# Altium project PCB_Project.PrjPcb
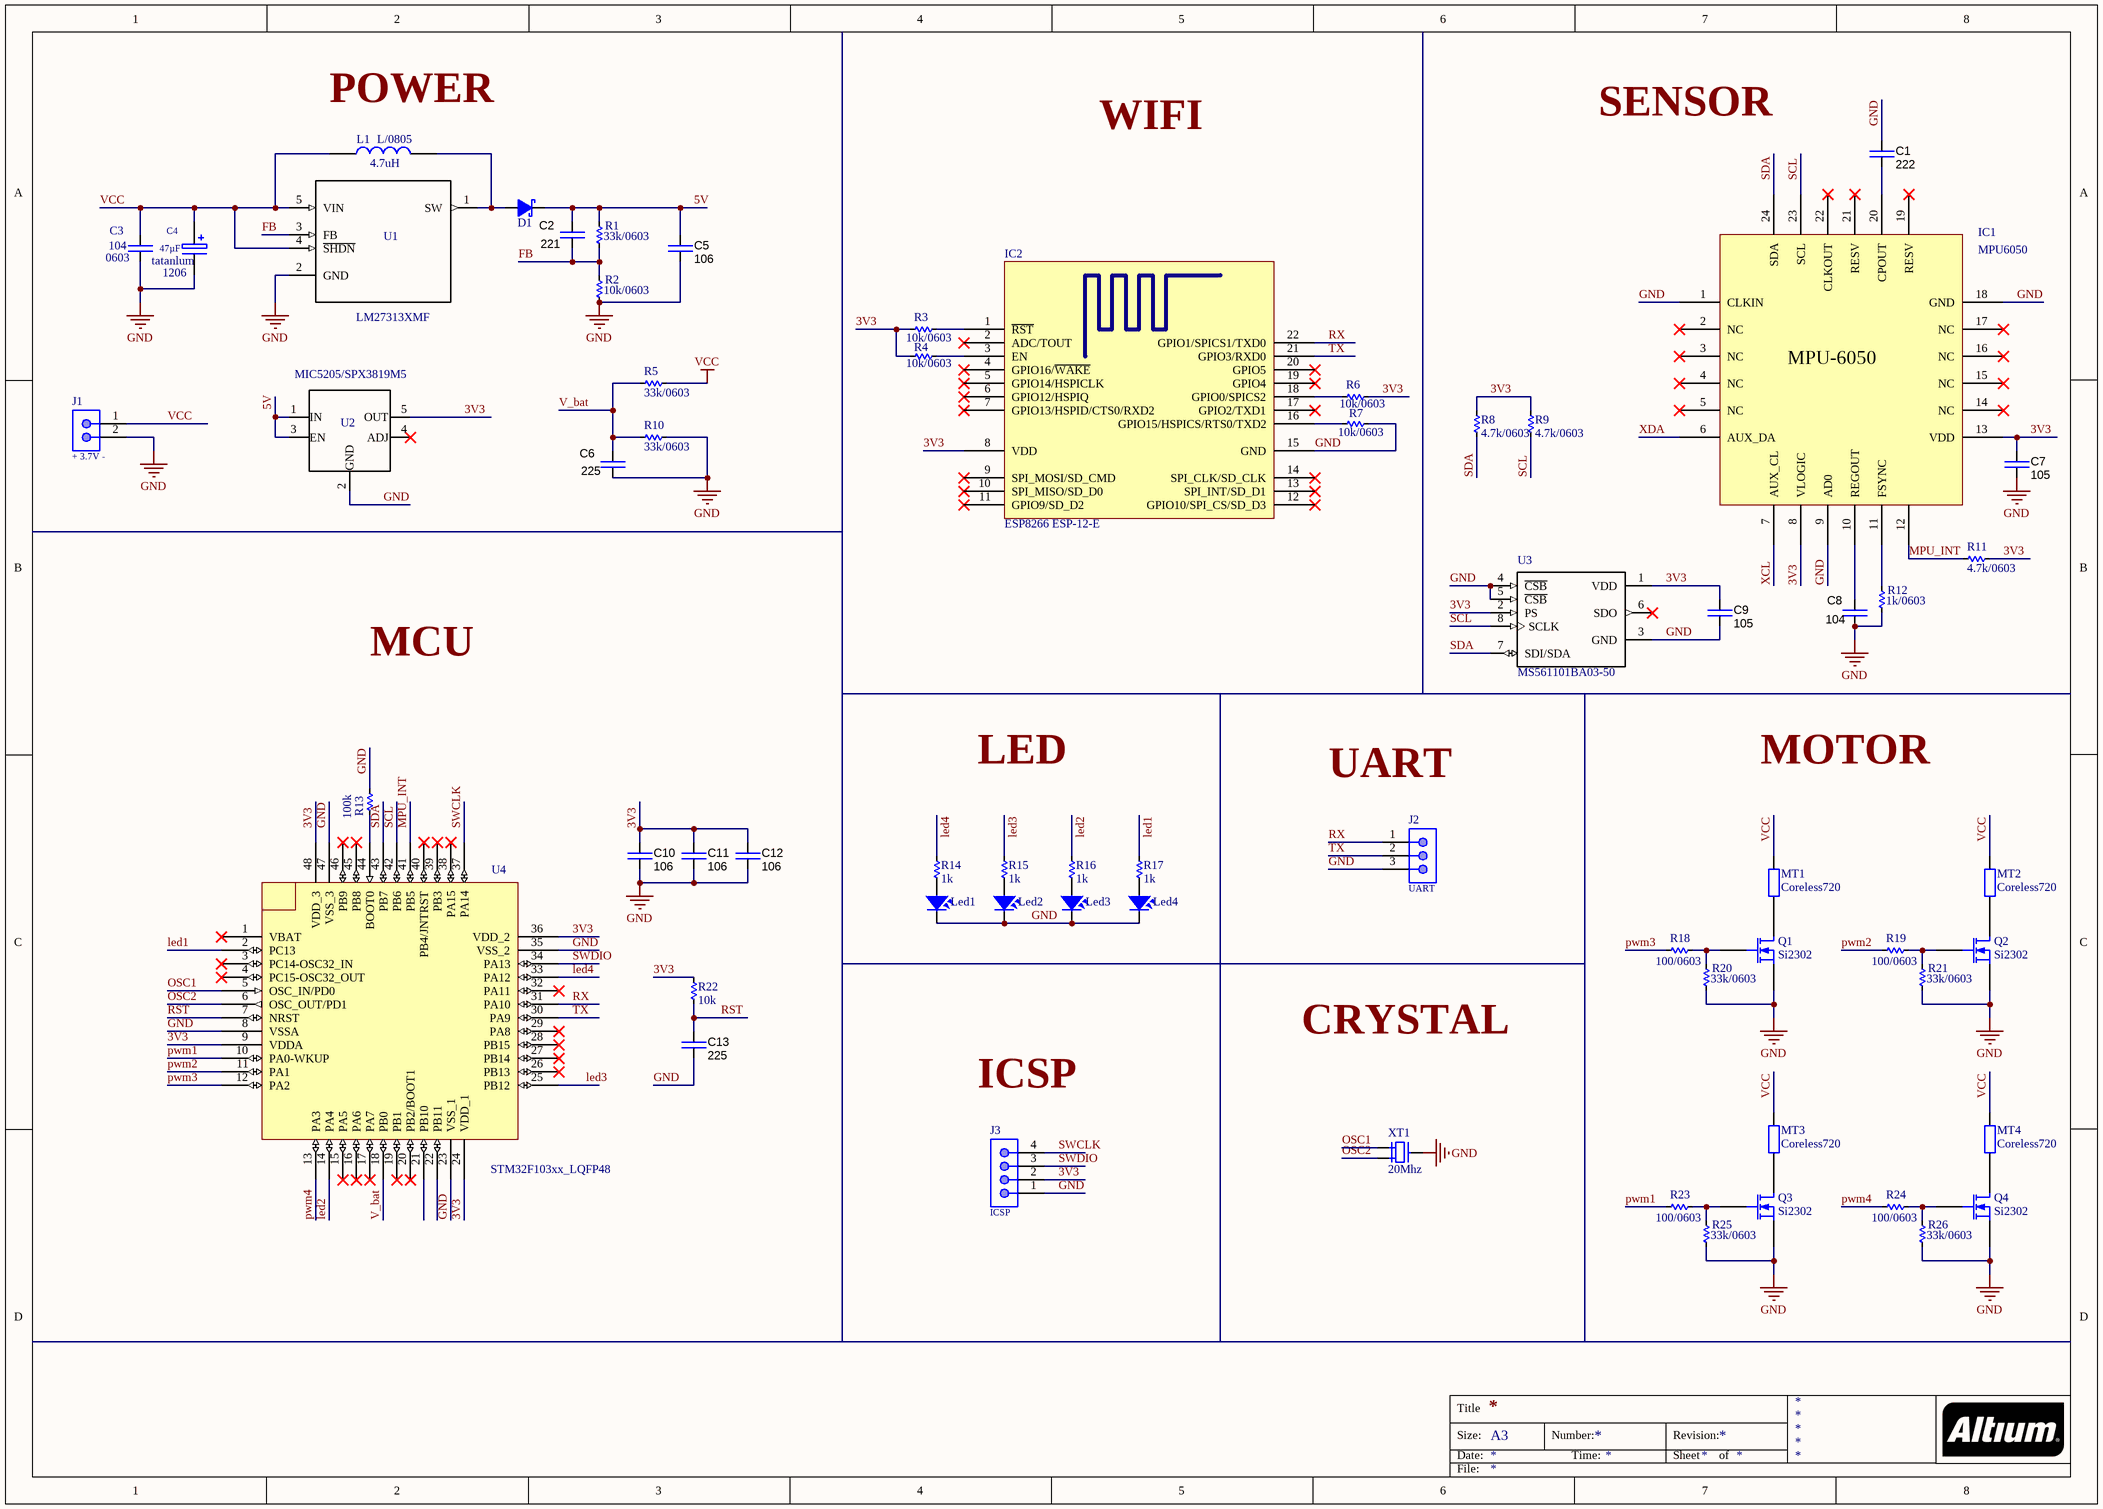
[diagram p0: Sheet1.SchDoc]
1 sheet, 63 parts. Net scope: global (net labels, ports and power ports of the same name join across sheets).
Board file: PCB1.PcbDoc

## Sheet Sheet1.SchDoc
size A3

### Parts
C1  222  [CAPC1608X90N]
C2  221  [CAPC1608X90N]
C3  104  Package / Case: 0603  [CAPC1608X90N]
C4  tatanlum  size: 1206  [CM_S_1206]
C5  106  [CAPC1608X90N]
C6  225  [CAPC1608X90N]
C7  105  [CAPC1608X90N]
C8  104  [CAPC1608X90N]
C9  105  [CAPC1608X90N]
C10  106  [CAPC1608X90N]
C11  106  [CAPC1608X90N]
C12  106  [CAPC1608X90N]
C13  225  [CAPC1608X90N]
D1  Diode  Schottky 1N5819  [DO-214AC]  (value not drawn)
IC1  MPU6050  [MPU6050]
IC2  ESP8266 ESP-12-E  [ESP8266 ESP-12-E]
J1  + 3.7V -  [62000211121]
J2  UART  [62000311121]
J3  ICSP  [62000411121]
L1  L/0805  value 4.7uH  [SM-IND-0805]
Led1  LED  [LED-0805-Red]  (value not drawn)
Led2  LED  [LED-0805-Red]  (value not drawn)
Led3  LED  [LED-0805-Red]  (value not drawn)
Led4  LED  [LED-0805-Red]  (value not drawn)
MT1  Coreless720  [SM-0805]
MT2  Coreless720  [SM-0805]
MT3  Coreless720  [SM-0805]
MT4  Coreless720  [SM-0805]
Q1  Si2302  [SOT23]
Q2  Si2302  [SOT23]
Q3  Si2302  [SOT23]
Q4  Si2302  [SOT23]
R1  33k/0603  [RES-SMD-0603]
R2  10k/0603  [RES-SMD-0603]
R3  10k/0603  [RES-SMD-0603]
R4  10k/0603  [RES-SMD-0603]
R5  33k/0603  [RES-SMD-0603]
R6  10k/0603  [RES-SMD-0603]
R7  10k/0603  [RES-SMD-0603]
R8  4.7k/0603  [RES-SMD-0603]
R9  4.7k/0603  [RES-SMD-0603]
R10  33k/0603  [RES-SMD-0603]
R11  4.7k/0603  [RES-SMD-0603]
R12  1k/0603  [RES-SMD-0603]
R13  100k  [RES-SMD-0603]
R14  1k  [RES-SMD-0603]
R15  1k  [RES-SMD-0603]
R16  1k  [RES-SMD-0603]
R17  1k  [RES-SMD-0603]
R18  100/0603  [RES-SMD-0603]
R19  100/0603  [RES-SMD-0603]
R20  33k/0603  [RES-SMD-0603]
R21  33k/0603  [RES-SMD-0603]
R22  10k  [RES-SMD-0603]
R23  100/0603  [RES-SMD-0603]
R24  100/0603  [RES-SMD-0603]
R25  33k/0603  [RES-SMD-0603]
R26  33k/0603  [RES-SMD-0603]
U1  LM27313XMF  [SOT95P285X120-5N]
U2  MIC5205/SPX3819M5  [SOT-23-5]
U3  MS561101BA03-50  [SON125P500X300X100-8N]
U4  STM32F103xx_LQFP48  [STM32_LQPF48]
XT1  20Mhz  [CRYSTAL CSTCE20M0V53-R0]

### Nets
GND: C1.2 C3.1 C4.2 C5.1 C6.1 C7.1 C8.1 C9.1 C10.1 C11.1 C12.1 C13.1 IC1.1(CLKIN) IC1.9(AD0) IC1.18(GND) IC2.15(GND) J1.2 J2.3 J3.1 Led1.2 Led2.2 Led3.2 Led4.2 Q1.2(S) Q2.2(S) Q3.2(S) Q4.2(S) R2.2 R7.1 R10.2 R12.2 R13.2 R20.2 R21.2 R25.2 R26.2 U1.2(GND) U2.2(GND) U3.3(GND) U3.4(~{CSB}) U3.5(~{CSB}) U4.8(VSSA) U4.23(VSS_1) U4.35(VSS_2) U4.47(VSS_3) XT1.2
VCC: C3.2 C4.1 J1.1 L1.1 MT1.2 MT2.2 MT3.2 MT4.2 R5.2 U1.4(~{SHDN}) U1.5(VIN)
3V3: C7.2 C9.2 C10.2 C11.2 C12.2 IC1.8(VLOGIC) IC1.13(VDD) IC2.8(VDD) J3.2 R3.2 R4.2 R6.1 R8.2 R9.2 R11.2 R22.2 U2.5(OUT) U3.1(VDD) U3.2(PS) U4.9(VDDA) U4.24(VDD_1) U4.36(VDD_2) U4.48(VDD_3)
5V: C2.2 C5.2 D1.K R1.1 U2.1(IN) U2.3(EN)
FB: C2.1 R1.2 R2.1 U1.3(FB)
led1: R17.2 U4.2(PC13)
led2: R16.2 U4.14(PA4)
led3: R15.2 U4.25(PB12)
led4: R14.2 U4.33(PA12)
MPU_INT: IC1.12 R11.1 U4.41(PB5)
OSC1: U4.5(OSC_IN/PD0) XT1.1
OSC2: U4.6(OSC_OUT/PD1) XT1.3
pwm1: R23.1 U4.10(PA0-WKUP)
pwm2: R19.1 U4.11(PA1)
pwm3: R18.1 U4.12(PA2)
pwm4: R24.1 U4.13(PA3)
RST: C13.2 R22.1 U4.7(NRST)
RX: IC2.22(GPIO1/SPICS1/TXD0) J2.1 U4.31(PA10)
SCL: IC1.23(SCL) R9.1 U3.8(SCLK) U4.42(PB6)
SDA: IC1.24(SDA) R8.1 U3.7(SDI/SDA) U4.43(PB7)
SWCLK: J3.4 U4.37(PA14)
SWDIO: J3.3 U4.34(PA13)
TX: IC2.21(GPIO3/RXD0) J2.2 U4.30(PA9)
V_bat: C6.2 R5.1 R10.1 U4.18(PB0)
XCL: IC1.7(AUX_CL)
XDA: IC1.6(AUX_DA)
NetC1_1: C1.1 IC1.20(CPOUT)
NetC8_2: C8.2 IC1.10(REGOUT)
NetD1_A: D1.A L1.2 U1.1(SW)
NetIC1_11: IC1.11(FSYNC) R12.1
NetIC2_1: IC2.1(~{RST}) R3.1
NetIC2_3: IC2.3(EN) R4.1
NetIC2_16: IC2.16(GPIO15/HSPICS/RTS0/TXD2) R7.2
NetIC2_18: IC2.18(GPIO0/SPICS2) R6.2
NetLed1_1: Led1.1 R14.1
NetLed2_1: Led2.1 R15.1
NetLed3_1: Led3.1 R16.1
NetLed4_1: Led4.1 R17.1
NetMT1_1: MT1.1 Q1.3(D)
NetMT2_1: MT2.1 Q2.3(D)
NetMT3_1: MT3.1 Q3.3(D)
NetMT4_1: MT4.1 Q4.3(D)
NetQ1_1: Q1.1(G) R18.2 R20.1
NetQ2_1: Q2.1(G) R19.2 R21.1
NetQ3_1: Q3.1(G) R23.2 R25.1
NetQ4_1: Q4.1(G) R24.2 R26.1
NetR13_1: R13.1 U4.44(BOOT0)

Not connected (* = marked no-connect by the designer): IC1 2(NC)* 3(NC)* 4(NC)* 5(NC)* 14(NC)* 15(NC)* 16(NC)* 17(NC)* 19(RESV)* 21(RESV)* 22(CLKOUT)*; IC2 2(ADC/TOUT)* 4(GPIO16/~{WAKE})* 5(GPIO14/HSPICLK)* 6(GPIO12/HSPIQ)* 7(GPIO13/HSPID/CTS0/RXD2)* 9(SPI_MOSI/SD_CMD)* 10(SPI_MISO/SD_D0)* 11(GPIO9/SD_D2)* 12(GPIO10/SPI_CS/SD_D3)* 13(SPI_INT/SD_D1)* 14(SPI_CLK/SD_CLK)* 17(GPIO2/TXD1)* 19(GPIO4)* 20(GPIO5)*; U2 4(ADJ)*; U3 6(SDO)*; U4 1(VBAT)* 3(PC14-OSC32_IN)* 4(PC15-OSC32_OUT)* 15(PA5)* 16(PA6)* 17(PA7)* 19(PB1)* 20(PB2/BOOT1)* 21(PB10) 22(PB11) 26(PB13)* 27(PB14)* 28(PB15)* 29(PA8)* 32(PA11)* 38(PA15)* 39(PB3)* 40(PB4/JNTRST)* 45(PB8)* 46(PB9)*

### Notes on the sheet
- (near L1) POWER
- WIFI
- SENSOR
- MCU
- LED
- UART
- MOTOR
- CRYSTAL
- ICSP
- Title
- Size:
- Date:
- A3
- Number:
- Time:
- Revision:
- Sheet
- of
- File:
- (in symbol CAP Tatalium) 47µF
- (in symbol MPU6050) MPU-6050

### Library data of the parts
C1 C2 C5-C13 = CAP C_0603: Capacitor SMD Cer 470nF 10% 16V X7R 0603; Manufacturer 1: Murata Electronics North America; Manufacturer Part Number 1: GRM188R71C474KA88D; Ratings: 16V; X7R; Material: ceramic; SCDType: spec; Package / Case: 0603 (1608 metric); Tolerance: ±10%; Manufacturer 2: TDK Corporation; Manufacturer Part Number 2: C1608X7R1C474K; Supplier 1: Digi-Key; Supplier Part Number 1: 490-3295-2-ND; Supplier 2: Digi-Key; Supplier Part Number 2: 445-5192-2-ND; Supplier 3: Digi-Key; Supplier Part Number 3: 587-1250-2-ND; Manufacturer 3: Taiyo Yuden; Manufacturer Part Number 3: EMK107B7474KA-T; Manufacturer 4: Samsung; Manufacturer Part Number 4: CL10B474KONE; ComponentLink1URL: http://psearch.murata.com/capacitor/product/GRM188R71C474KA88#.pdf; ComponentLink1Description: http://psearch.murata.com/capacitor/product/GRM188R71C474KA88#.pdf; ComponentLink2URL: http://product.tdk.com/capacitor/mlcc/en/documents/mlcc_commercial_general_en.pdf; ComponentLink2Description: http://product.tdk.com/capacitor/mlcc/en/documents/mlcc_commercial_general_en.pdf; ComponentLink3URL: http://www.yuden.co.jp/or/product/category/capacitor/EMK107B7474KA-T.pdf; ComponentLink3Description: http://www.yuden.co.jp/or/product/category/capacitor/EMK107B7474KA-T.pdf
  C1: Value: 222
  C2: Value: 221
  C5 C10-C12: Value: 106
  C6 C13: Value: 225
  C7 C9: Value: 105
  C8: Value: 104
C3 = CAP C_0603: Capacitor SMD 224/0603, Addr:Linhkien69.vn; Manufacturer 1: Murata Electronics North America; Manufacturer Part Number 1: GRM188R71C474KA88D; Tolerance: ±10%; Ratings: 16V; X7R; Material: ceramic; SCDType: spec; Value: 470n; Manufacturer 2: TDK Corporation; Manufacturer Part Number 2: C1608X7R1C474K; Supplier 1: Digi-Key; Supplier Part Number 1: 490-3295-2-ND; Supplier 2: Digi-Key; Supplier Part Number 2: 445-5192-2-ND; Supplier 3: Digi-Key; Supplier Part Number 3: 587-1250-2-ND; Manufacturer 3: Taiyo Yuden; Manufacturer Part Number 3: EMK107B7474KA-T; Manufacturer 4: Samsung; Manufacturer Part Number 4: CL10B474KONE; ComponentLink1URL: http://psearch.murata.com/capacitor/product/GRM188R71C474KA88#.pdf; ComponentLink1Description: http://psearch.murata.com/capacitor/product/GRM188R71C474KA88#.pdf; ComponentLink2URL: http://product.tdk.com/capacitor/mlcc/en/documents/mlcc_commercial_general_en.pdf; ComponentLink2Description: http://product.tdk.com/capacitor/mlcc/en/documents/mlcc_commercial_general_en.pdf; ComponentLink3URL: http://www.yuden.co.jp/or/product/category/capacitor/EMK107B7474KA-T.pdf; ComponentLink3Description: http://www.yuden.co.jp/or/product/category/capacitor/EMK107B7474KA-T.pdf
C4 = CAP Tatalium: Tatalium SMD 47uf/1206, Addr:Linhkien69.vn; address: tuhu
D1 = Diode  Schottky 1N5819: Diode SS24 SMD 0805, Addr:Linhkien69.vn; Value: 1N4007
IC1 = MPU6050: Addr:Banlinhkien.vn
J1 = 62000211121: WR-PHD Pin Header, THT, pitch 2mm, Single Row, Vertical, 2pin; Pin Number: 2; Gender: Male; Rated Current: 2A; Working Voltage: 200VAC; Withstanding Voltage: 500VAC; Contact Resistance: 20mOhm; ComponentLink1Description: Manufacturer; ComponentLink1URL: http://www.we-online.de; ComponentLink2Description: Datasheet; ComponentLink2URL: https://katalog.we-online.de/em/datasheet/62000211121.pdf; Part Number: 62000211121; Published Date: June 2019; Publisher: Wurth Elektronik; Pitch: 2mm; Operating Temperature: -40 to +105degC; Mounting Technology: THT; Packaging: Bag; Row Number: Single; Orientation: Vertical
J2 = 62000311121: WR-PHD Pin Header, THT, pitch 2mm, Single Row, Vertical, 3pin; Pin Number: 3; Gender: Male; Rated Current: 2A; Working Voltage: 200VAC; Withstanding Voltage: 500VAC; Contact Resistance: 20mOhm; ComponentLink1Description: Manufacturer; ComponentLink1URL: http://www.we-online.de; ComponentLink2Description: Datasheet; ComponentLink2URL: https://katalog.we-online.de/em/datasheet/62000311121.pdf; Part Number: 62000311121; Published Date: June 2019; Publisher: Wurth Elektronik; Pitch: 2mm; Operating Temperature: -40 to +105degC; Mounting Technology: THT; Packaging: Bag; Row Number: Single; Orientation: Vertical
J3 = 62000411121: WR-PHD Pin Header, THT, pitch 2mm, Single Row, Vertical, 4pin; Pin Number: 4; Gender: Male; Rated Current: 2A; Working Voltage: 200VAC; Withstanding Voltage: 500VAC; Contact Resistance: 20mOhm; ComponentLink1Description: Manufacturer; ComponentLink1URL: http://www.we-online.de; ComponentLink2Description: Datasheet; ComponentLink2URL: https://katalog.we-online.de/em/datasheet/62000411121.pdf; Part Number: 62000411121; Published Date: June 2019; Publisher: Wurth Elektronik; Pitch: 2mm; Operating Temperature: -40 to +105degC; Mounting Technology: THT; Packaging: Bag; Row Number: Single; Orientation: Vertical
L1 = Inductor Iron: Inductor SMD 4.7uH/0805, Addr:Linhkien69.vn; address: Minh Hà /  Tuhu
Led1-Led4 = LED SMD: LED SMD0805                Addr:Linhkien69.vn; Value: LED 3 - 5 ly 2 Colour
MT1-MT4 = RM: Resistor SMD; Value: 1K
Q1-Q4 = Si2302DS: Transistor SMD            Addr:Banlinhkien.vn; Published: 8-Jun-2000; LatestRevisionDate: 17-Jul-2002; LatestRevisionNote: Re-released for DXP Platform.; PackageVersion: 1995/1996; PackageReference: E3; Publisher: Altium Limited; PackageDescription: TO, Flat Index; 3 In-Line, Axial Leads; Body Dia. 4.6mm; Lead Dia. 0.5 mm (max)
R1 R5 R10 R18-R21 R23-R26 = Res-SMD: Resistor SMD 33k/0603, Addr:Linhkien69.vn; Manufacturer: Generic Components; Class: Passive; Published: 08/06/2000; Publisher: Altium Hobart Technology Centre
R2 = Res-SMD: Resistor SMD 10k/0603, Addr:Linhkien69.vn; Manufacturer: Generic Components; Class: Passive; Published: 08/06/2000; Publisher: Altium Hobart Technology Centre
R3 R4 R6-R9 R11 = Res-SMD: Resistor SMD 4.7k/0603, Addr:Linhkien69.vn; Manufacturer: Generic Components; Class: Passive; Published: 08/06/2000; Publisher: Altium Hobart Technology Centre
R12 R14-R17 = Res-SMD: Resistor SMD 1k/0603, Addr:Linhkien69.vn; Manufacturer: Generic Components; Class: Passive; Published: 08/06/2000; Publisher: Altium Hobart Technology Centre
R13 R22 = Res-SMD: Resistor; Manufacturer: Generic Components; Class: Passive; Published: 08/06/2000; Publisher: Altium Hobart Technology Centre
U1 = LM27313XMF: Boost SMD/SOT95,  Addr:Banlinhkien.vn; MP: LM27313XMF/NOPB; MF: Texas Instruments; SnapEDA_Link: https://www.snapeda.com/parts/LM27313XMF/NOPB/Texas%20Instruments/view-part/?ref=snap; Package: SOT-23-5 Texas Instruments; Availability: Good; Price: 1.12 USD; Value: *
U2 = PMIC-MIC5205-3.3YMSTR(SOT23-5): 3.3V SMD/SOT23,    Addr:Banlinhkien.vn; MP: MIC5205-3.3YM5 TR; MF: Micrel; SnapEDA_Link: https://www.snapeda.com/parts/MIC5205-3.3YM5%20TR/Micrel/view-part/?ref=snap; Package: SOT-23-5 Micrel; Availability: Good; Price: 0.31 USD; Value: *
U3 = MS561101BA03-50: Addr:Banlinhkien.vn; MF: TE Connectivity; Package: SMD-8 TE Connectivity; MP: MS561101BA03-50; Link: http://www.te.com/usa-en/product-MS561101BA03-50.html; EU_RoHS_Compliance: Compliant; Availability: Good; Price: 8.41 USD; SnapEDA_Link: https://www.snapeda.com/parts/MS561101BA03-50/TE%20Connectivity%20/%20DEUTSCH/view-part/?ref=snap; Value: *
U4 = STM32F103xx_LQFP48: STM32 ARM-based 32-bit MCU with 64 Kbytes Flash, 48-pin LQFP, Industrial Temperature; Published: 30-May-2008; DatasheetVersion: rev6, Mar-2008; PackageVersion: Mar-2008; PackageReference: LQFP48; Publisher: Altium Limited; PackageDescription: 48-Pin Low-Profile Quad Flat Pack, 7 x 7 mm Body, 0.5 mm Pitch (LQFP48); ComponentLink1Description: Manufacturer Link; ComponentLink1URL: www.st.com/stm32; ComponentLink2Description: Datasheet; ComponentLink2URL: http://www.st.com/stonline/products/literature/ds/13587.pdf
XT1 = CRYSTAL 3 Chan: Crystal For all Crystal 2pin.; Value: 4Mhz